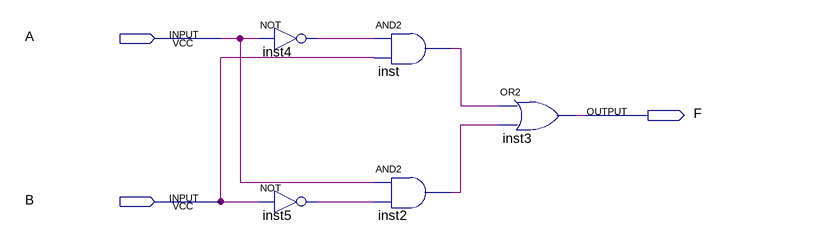
[diagram p0: schematic sheet]
// Quartus schematic lab3.bdf as structural Verilog: 5 symbols, 3 pins
module lab3 (
  input  A,
  input  B,
  output F
);

  wire inst2_out, inst4_out, inst5_out, inst_out;

  not inst4 (inst4_out, A);
  not inst5 (inst5_out, B);
  and inst (inst_out, inst4_out, B);
  and inst2 (inst2_out, A, inst5_out);
  or inst3 (F, inst_out, inst2_out);
endmodule
